# Altium schematic sheet Raspberry_DC-HD_v1.SchDoc
size A4
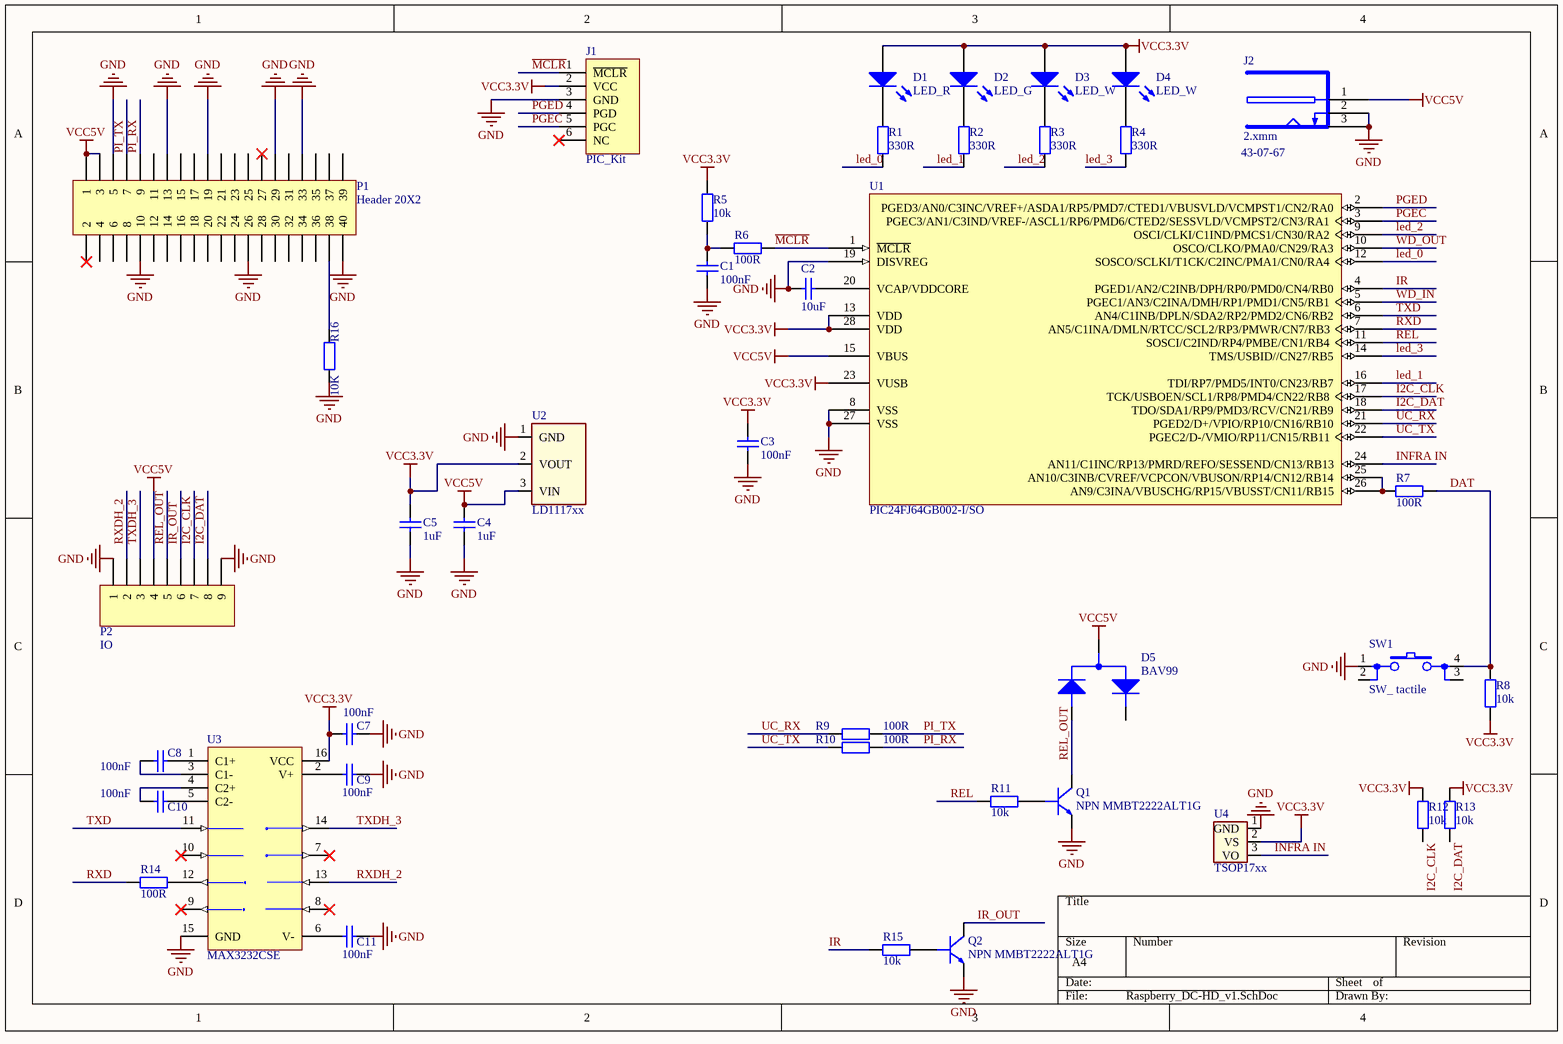
[diagram p0: Raspberry_DC-HD_v1.SchDoc]

## Parts
C1  100nF  [FP_0603_CAP_080]
C2  10uF  [FP_0603_CAP_080]
C3  100nF  [FP_0603_CAP_080]
C4  1uF  [FP_0603_CAP_080]
C5  1uF  [FP_0603_CAP_080]
C7  100nF  [FP_0603_CAP_080]
C8  100nF  [FP_0603_CAP_080]
C9  100nF  [FP_0603_CAP_080]
C10  100nF  [FP_0603_CAP_080]
C11  100nF  [FP_0603_CAP_080]
D1  LED_R  [1206 LED Reversed]
D2  LED_G  [1206 LED Reversed]
D3  LED_W  [1206 LED Reversed]
D4  LED_W  [1206 LED Reversed]
D5  BAV99  [DIODE_SOT23_serial]
J1  PIC_Kit  [HDR1X6]
J2  2.xmm  Order info: 43-07-67  [FP_DC_TAP_ANYA]
P1  Header 20X2  [Header_2X20_pin_2.54]
P2  IO  [Euroblock 3.5pitch 9P]
Q1  NPN MMBT2222ALT1G  [TR_SOT23]
Q2  NPN MMBT2222ALT1G  [TR_SOT23]
R1  330R  [FP_0603_RES]
R2  330R  [FP_0603_RES]
R3  330R  [FP_0603_RES]
R4  330R  [FP_0603_RES]
R5  10k  [FP_0603_RES]
R6  100R  [FP_0603_RES]
R7  100R  [FP_0603_RES]
R8  10k  [FP_0603_RES]
R9  100R  [FP_0603_RES]
R10  100R  [FP_0603_RES]
R11  10k  [FP_0603_RES]
R12  10k  [FP_0603_RES]
R13  10k  [FP_0603_RES]
R14  100R  [FP_0603_RES]
R15  10k  [FP_0603_RES]
R16  10K  [FP_0603_RES]
SW1  SW_ tactile  [flat_smd_button]
U1  PIC24FJ64GB002-I/SO  [SSOP-28]
U2  LD1117xx  [SUPPLY_SOT223]
U3  MAX3232CSE  [DIGITAL_SOIC16]
U4  TSOP17xx  [TSOP17xx]

## Nets
GND: C1.1 C2.2 C3.1 C4.1 C5.1 C7.2 C9.2 C11.2 J1.3(GND) J2.2(GND) J2.3(GND) P1.5 P1.10 P1.13 P1.19 P1.26 P1.29 P1.33 P1.40 P2.1 P2.9 Q1.E Q2.E R16.1 SW1.1 U1.8(VSS) U1.19(DISVREG) U1.27(VSS) U2.1(GND) U3.15(GND) U4.1(GND)
VCC3.3V: C3.2 C5.2 C7.1 D1.1(A) D2.1(A) D3.1(A) D4.1(A) J1.2(VCC) R5.1 R8.2 R12.1 R13.1 U1.13(VDD) U1.23(VUSB) U1.28(VDD) U2.2(VOUT) U3.16(VCC) U4.2(VS)
VCC5V: C4.2 D5.COM J2.1(9V) P1.1 P1.3 P2.4 U1.15(VBUS) U2.3(VIN)
DAT: R7.1 R8.1 SW1.4
I2C_CLK: P2.7 R12.2 U1.17(TCK/USBOEN/SCL1/RP8/PMD4/CN22/RB8)
I2C_DAT: P2.8 R13.2 U1.18(TDO/SDA1/RP9/PMD3/RCV/CN21/RB9)
INFRA IN: U1.24(AN11/C1INC/RP13/PMRD/REFO/SESSEND/CN13/RB13) U4.3(VO)
IR: R15.1 U1.4(PGED1/AN2/C2INB/DPH/RP0/PMD0/CN4/RB0)
IR_OUT: P2.6 Q2.C
led_0: R1.2 U1.12(SOSCO/SCLKI/T1CK/C2INC/PMA1/CN0/RA4)
led_1: R2.2 U1.16(TDI/RP7/PMD5/INT0/CN23/RB7)
led_2: R3.2 U1.9(OSCI/CLKI/C1IND/PMCS1/CN30/RA2)
led_3: R4.2 U1.14(TMS/USBID//CN27/RB5)
~{MCLR}: J1.1(~{MCLR}) R6.1 U1.1(~{MCLR})
PGEC: J1.5(PGC) U1.3(PGEC3/AN1/C3IND/VREF-/ASCL1/RP6/PMD6/CTED2/SESSVLD/VCMPST2/CN3/RA1)
PGED: J1.4(PGD) U1.2(PGED3/AN0/C3INC/VREF+/ASDA1/RP5/PMD7/CTED1/VBUSVLD/VCMPST1/CN2/RA0)
PI_RX: P1.9 R10.1
PI_TX: P1.7 R9.1
REL: R11.1 U1.11(SOSCI/C2IND/RP4/PMBE/CN1/RB4)
REL_OUT: D5.A P2.5 Q1.C
RXD: R14.2 U1.7(AN5/C1INA/DMLN/RTCC/SCL2/RP3/PMWR/CN7/RB3)
RXDH_2: P2.2 U3.13(R1IN)
TXD: U1.6(AN4/C1INB/DPLN/SDA2/RP2/PMD2/CN6/RB2) U3.11(T1IN)
TXDH_3: P2.3 U3.14(T1OUT)
UC_RX: R9.2 U1.21(PGED2/D+/VPIO/RP10/CN16/RB10)
UC_TX: R10.2 U1.22(PGEC2/D-/VMIO/RP11/CN15/RB11)
WD_IN: U1.5(PGEC1/AN3/C2INA/DMH/RP1/PMD1/CN5/RB1)
WD_OUT: U1.10(OSCO/CLKO/PMA0/CN29/RA3)
NetC1_2: C1.2 R5.2 R6.2
NetC2_1: C2.1 U1.20(VCAP/VDDCORE)
NetC8_1: C8.1 U3.3(C1-)
NetC8_2: C8.2 U3.1(C1+)
NetC9_1: C9.1 U3.2(V+)
NetC10_1: C10.1 U3.4(C2+)
NetC10_2: C10.2 U3.5(C2-)
NetC11_1: C11.1 U3.6(V-)
NetD1_2: D1.2(K) R1.1
NetD2_2: D2.2(K) R2.1
NetD3_2: D3.2(K) R3.1
NetD4_2: D4.2(K) R4.1
NetP1_38: P1.38 R16.2
NetQ1_B: Q1.B R11.2
NetQ2_B: Q2.B R15.2
NetR7_2: R7.2 U1.25(AN10/C3INB/CVREF/VCPCON/VBUSON/RP14/CN12/RB14) U1.26(AN9/C3INA/VBUSCHG/RP15/VBUSST/CN11/RB15)
NetR14_1: R14.1 U3.12(R1OUT)

Not connected (* = marked no-connect by the designer): D5 K; J1 6(NC)*; P1 2* 4 6 8 11 12 14 15 16 17 18 20 21 22 23 24 25 27* 28 30 31 32 34 35 36 37 39; SW1 2 3; U3 7(T2OUT)* 8(R2IN)* 9(R2OUT)* 10(T2IN)*

## Library data of the parts
C1-C5 C7-C11 = CAP: Capacitor
  C1 C3 C7-C11: Value: 100nF; Order info: 82-04-85
  C2: Value: 10uF; Order info: 82-07-81
  C4 C5: Value: 1uF; Order info: 82-03-78
D1-D4 = LED: Typical LED; pin to pad: 1>A 2>K
  D1: Order info: 95-01-12
  D2: Order info: 95-02-99
  D3 D4: Order info: 95-02-03
J1 = PIC_Kit: PIC Kit connector; Order info: Programozó tüskesor
J2 = DC_TAP_ANYA: 2.xmm DC HEBA25 TÁPFESZÜLTSÉG ALJZAT ZÁRT, NYÁKBA 90°
P1 = Header 20X2: Header, 20-Pin, Dual row; LatestRevisionDate: 17-Jul-2002; LatestRevisionNote: Re-released for DXP Platform.; Publisher: Altium Limited; Order info: 43-06-67
P2 = Header 9: Header, 9-Pin; Order info: Euroblock 9P connector; LatestRevisionDate: 17-Jul-2002; LatestRevisionNote: Re-released for DXP Platform.; Publisher: Altium Limited
Q1 Q2 = NPN: Order info: 86-00-73
R1-R4 R6 R7 R9 R10 R14 R16 = RES: Resistor
  R1-R4: Value: 330R; Order info: 81-17-48
  R6 R7 R9 R10 R14: Value: 100R; Order info: 81-10-16
  R16: Value: 10K; Order info: 81-10-38
R5 R8 R11-R13 R15 = Res3: Resistor; Tűrés: 5%; Value: 10k; Order info: 81-10-38
U1 = PIC24FJ64GB002-I/SO: 16-Bit Flash Microcontroller with USB On-The-Go and nanoWatt XLP, 64KB Flash, 8KB SRAM, 28-Pin SOIC, Industrial Temperature; FirstPublished: 2-Dec-2009; DatasheetVersion: revC, Oct-2009; PackageVersion: revBB, Aug-2009; PackageReference: QFN-ML28; Publisher: Altium Limited; PackageDescription: 28-Lead Plastic Quad Flat, No Lead Package (ML) - 6x6 mm Body [QFN] with 0.55 mm Contact Length; Supplier 1: Digi-Key; Supplier Part Number 1: PIC24FJ64GB002-I/ML-ND; Supplier 2: Farnell; Supplier Part Number 2: 1777472; Supplier 3: Newark; Supplier Part Number 3: 07P9737; Code_JEDEC: MO-220; Code_IPC: QFN65P600X600-28V; ComponentLink1Description: Datasheet; ComponentLink1URL: http://ww1.microchip.com/downloads/en/DeviceDoc/39951b.pdf; ComponentLink2Description: Packaging Specification; ComponentLink2URL: http://www.microchip.com/stellent/groups/techpub_sg/documents/packagingspec/en012702.pdf; ComponentLink3Description: Microchip.com Home; ComponentLink3URL: http://www.microchip.com/; Order info: http://hu.farnell.com/microchip/pic24fj64gb002-i-so/mcu-16bit-pic24-32mhz-soic-28/dp/1778484?ost=PIC24FJ64GB002-I%2FSO
U2 = LD1117xx: LD1117xx 3,3V lin reg; Order info: 89-06-98
U3 = MAX3232CSE: 3.0V TO 5.5V, Low-Power, up to 1Mbps, True RS-232 Transceiver Using Four 0.1µF External Capacitor; Published: 16-Jan-2001; LatestRevisionDate: 13-Apr-2006; LatestRevisionNote: IPC-7351 Footprint Added.; DatasheetVersion: Mar-1999; PackageReference: NSO16; Publisher: Altium Limited; PackageDescription: 16-Pin Small Outline Integrated Circuit 1.27 mm Pitch; Code_JEDEC: MS-012-AC; Code_IPC: SOIC127P600-16; ComponentLink1Description: Manufacturer Link; ComponentLink1URL: http://www.maxim-ic.com/; ComponentLink2Description: Datasheet; ComponentLink2URL: http://pdfserv.maxim-ic.com/en/ds/MAX3222-MAX3241.pdf; Order info: 89-12-11
U4 = TSOP17xx: TSOP17xx IR receiver; Order info: http://hu.farnell.com/vishay/tsop1236/photodiode-ir-receiver-36khz/dp/4913048?ost=TSOP1
D5 = BAV99: Order info: 83-00-02
SW1 = SW_ tactile: Order info: 45-05-86